# Altium schematic sheet TJA1050.SchDoc
size A4
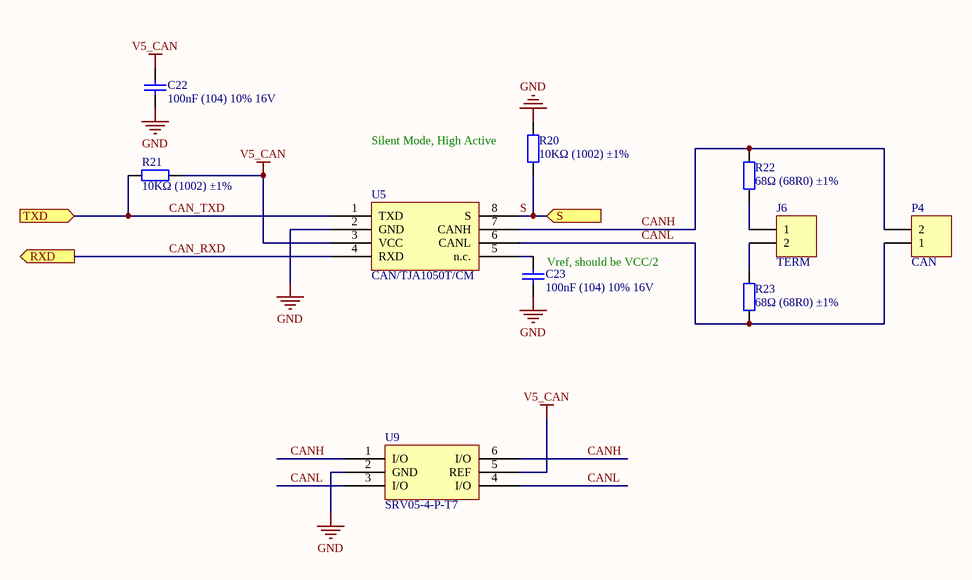
[diagram p0: TJA1050.SchDoc]

## Parts
C22  100nF (104) 10% 16V  [0402_C]
C23  100nF (104) 10% 16V  [0402_C]
J6  TERM  [HDR1X2]
P4  CAN  [WJ2EDGRC-5.08-2PxxR]
R20  10KΩ (1002) ±1%  [0402_R]
R21  10KΩ (1002) ±1%  [0402_R]
R22  68Ω (68R0) ±1%  [0603_R]
R23  68Ω (68R0) ±1%  [0603_R]
U5  CAN/TJA1050T/CM  [SOIC-8_150mil]
U9  SRV05-4-P-T7  [SOT-23-6]

## Ports
RXD (out), S (in), TXD (in)

## Nets
GND: C22.1 C23.1 R20.2 U5.2(GND) U9.2(GND)
V5_CAN: C22.2 R21.1 U5.3(VCC) U9.5(REF)
CAN_RXD: U5.4(RXD) ; port RXD
CAN_TXD: R21.2 U5.1(TXD) ; port TXD
CANH: P4.2 R22.2 U5.7(CANH) U9.1(I/O) U9.6(I/O)
CANL: P4.1 R23.1 U5.6(CANL) U9.3(I/O) U9.4(I/O)
S: R20.1 U5.8(S) ; port S
NetC23_2: C23.2 U5.5(n.c.)
NetJ6_1: J6.1 R22.1
NetJ6_2: J6.2 R23.2

## Notes on the sheet
- (near R20) Silent Mode, High Active
- (near C23) Vref, should be VCC/2

## Library data of the parts
C22 C23 = 0402 100nF (104) 10% 16V: 贴片电容; ComponentLink1Description: 供应商链接; ComponentLink1URL: http://www.szlcsc.com/product/details_1877.html; Package: 0402; Supplier: LC; SuppliersPartNumber: C1525
J6 P4 = Header 2: Header, 2-Pin; LatestRevisionDate: 17-Jul-2002; LatestRevisionNote: Re-released for DXP Platform.; Publisher: Altium Limited
R20 R21 = 0402 10KΩ (1002) 1%: 贴片电阻; ComponentLink1Description: 供应商链接; ComponentLink1URL: http://www.szlcsc.com/product/details_26487.html; Package: 0402; Supplier: LC; SuppliersPartNumber: C25744
R22 R23 = 0603 68Ω (68R0) 1%: 贴片电阻; ComponentLink1Description: 供应商链接; ComponentLink1URL: http://www.szlcsc.com/product/details_28341.html; Package: 0603; Supplier: LC; SuppliersPartNumber: C27592
U5 = CAN/TJA1050T/CM_[C6952]: CAN; ComponentLink1Description: 供应商链接; ComponentLink1URL: http://www.szlcsc.com/product/details_7424.html; Package: SOIC-8_150mil; Supplier: LC; SuppliersPartNumber: C6952
U9 = SRV05-4-P-T7_[C85364]: TVS; ComponentLink1Description: 供应商链接; ComponentLink1URL: http://www.szlcsc.com/product/details_86537.html; Package: SOT-23-6; Supplier: LC; SuppliersPartNumber: C85364